# Altium schematic sheet Input_Conditioner.SchDoc
size A4; SheetNumber: 5; SheetTotal: 8
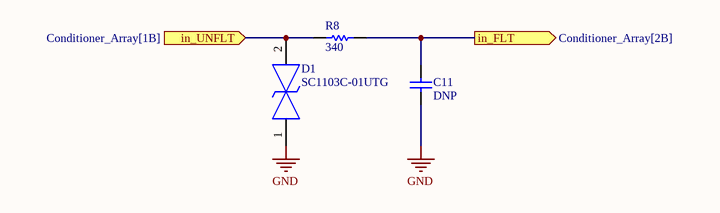
[diagram p0: Input_Conditioner.SchDoc]

## Parts
C11  value DNP  [FP-RC1608-IPC_A]  (hidden comment: Capacitor)
D1  SC1103C-01UTG  [SC1103C01UTG]
R8  340  [RESC1608X55X25LL10T15]

## Ports
in_FLT (out, see Conditioner_Array[2B]), in_UNFLT (in, see Conditioner_Array[1B])

## Nets
GND: C11.2 D1.1
in_FLT: C11.1 R8.2 ; port in_FLT
in_UNFLT: D1.2 R8.1 ; port in_UNFLT

## Library data of the parts
C11 = Capacitor: SimulationGenericComponent: True
D1 = SC1103C-01UTG: TVS Diode (Bi-directional); Manufacturer_Name: LITTELFUSE; Datasheet Link: https://www.littelfuse.com/media?resourcetype=datasheets&itemid=00ca821d-8080-42f3-aae6-7cab4684d809&filename=littelfuse-tvs-diode-array-sc1103c-01utg-datasheet-1; Height: 0.55mm; Manufacturer_Part_Number: SC1103C-01UTG; Mouser Part Number: 576-SC1103C-01UTG; Mouser Price/Stock: https://www.mouser.co.uk/ProductDetail/Littelfuse/SC1103C-01UTG?qs=Rp5uXu7WBW8S8u%2FopEdSug%3D%3D; Arrow Part Number: SC1103C-01UTG; Arrow Price/Stock: null?region=nac
R8 = CMP-2000-04016-1: Part Number: RC0603FR-07340RL; Manufacturer: Yageo